# EAGLE design ep_project (EAGLE 9.6.2)
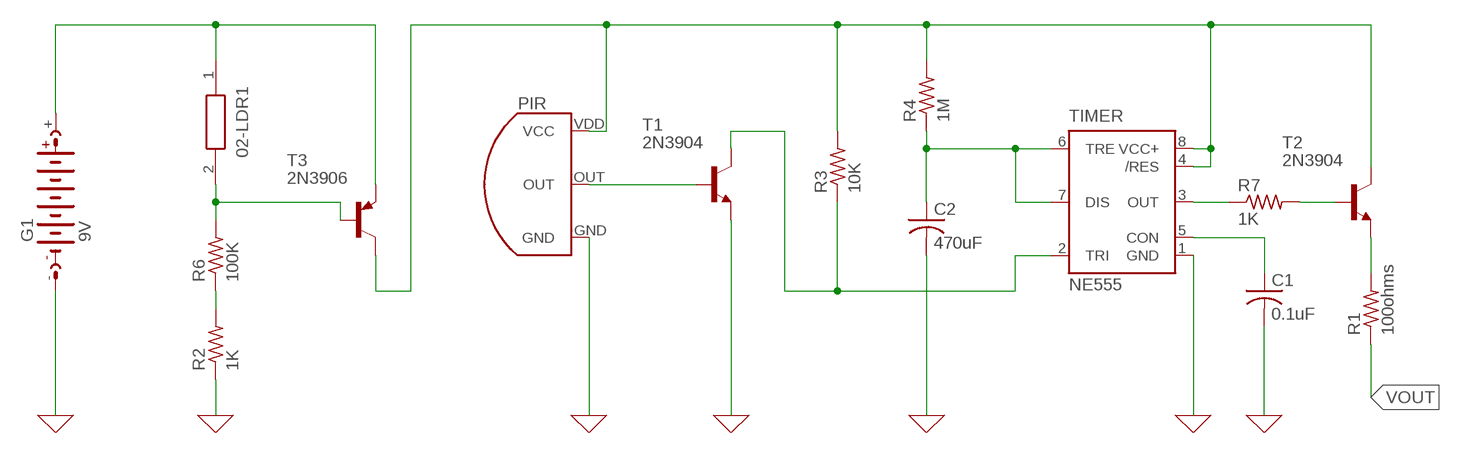
[diagram p0: schematic, sheet 1]

## Parts
C1  0.1uF  C-US025-024X044  [C025-024X044]
C2  470uF  C-US025-024X044  [C025-024X044]
G1  9V  AB9V  [AB9V]
PIR  EKMC4607112k  PIR_EKM4607112K  [TO-3]
R1  100ohms  R-US_M0805  [M0805]
R2  1K  R-US_M0805  [M0805]
R3  10K  R-US_M0805  [M0805]
R4  1M  R-US_M0805  [M0805]
R5  02-LDR1  [02LDR1]
R6  100K  R-US_M0805  [M0805]
R7  1K  R-US_M0805  [M0805]
T1  2N3904  [TO92]
T2  2N3904  [TO92]
T3  2N3906  [TO92]
TIMER  NE555  [DIL-08]

## Nets
0: C1.2 C2.2 G1.- PIR.GND R2.1 T1.3(E) TIMER.1(GND) ; supply symbol labelled GND
N$1: G1.+ R5.1 T3.3(E)
N$2: R5.2 R6.2 T3.2(B)
N$3: R2.2 R6.1
N$5: R3.1 T1.1(C) TIMER.2(TRI)
N$6: PIR.VDD(VCC) R3.2 R4.2 T2.1(C) T3.1(C) TIMER.4(/RES) TIMER.8(VCC+)
N$7: PIR.OUT T1.2(B)
N$8: C2.1 R4.1 TIMER.6(TRE) TIMER.7(DIS)
N$9: R1.2 T2.3(E)
N$11: R7.1 TIMER.3(OUT)
N$12: R7.2 T2.2(B)
N$13: C1.1 TIMER.5(CON)
VOUT: R1.1

## Library data of the parts
C1 = adafruit:C-US: CAPACITOR, American symbol; MF: KEMET; MPN: C0603C104M4RACTU.; OC_FARNELL: 1166968
C2 = adafruit:C-US: CAPACITOR, American symbol; MF: ILLINOIS CAPACITOR; MPN: 477CKE016M .; OC_FARNELL: 1203718
G1 = battery:AB9V: 9-V BATTERY CLIP; MF: KEYSTONE; MPN: 1294; OC_FARNELL: 1650674
PIR = Library:PIR_EKM: Panasonic EKMCX607112 PIR Sensor The low-power series of PIR sensors from Panasonic come in a 170 uA (4607) and 1 uA (1607) version.; MF: PANASONIC; MPN: EKMC1603111; OC_FARNELL: 2095731; PROD_ID: IC-15368
R1 = adafruit:R-US_: RESISTOR, American symbol; MF: MULTICOMP PRO; MPN: MCMF0W4FF1000A50; OC_FARNELL: 1652641
R2 R7 = adafruit:R-US_: RESISTOR, American symbol; MF: NEOHM - TE CONNECTIVITY; MPN: YR1B1K0CC; OC_FARNELL: 1083251
R3 = adafruit:R-US_: RESISTOR, American symbol; MF: NEOHM - TE CONNECTIVITY; MPN: YR1B10KCC; OC_FARNELL: 1083362
R4 = adafruit:R-US_: RESISTOR, American symbol; MF: VISHAY; MPN: MBB02070C1004FC100; OC_FARNELL: 2614373
R5 = 02-LDR1:02-LDR1: PHOTORESISTOR Source: Datasheet; DESCRIPTION: PHOTORESISTOR; HEIGHT: 2.4mm; MANUFACTURER_NAME: NTE; MANUFACTURER_PART_NUMBER: 02-LDR1; MF: EXCELITAS TECH; MPN: VT935G; OC_FARNELL: 1652638
R6 = adafruit:R-US_: RESISTOR, American symbol; MF: MULTICOMP PRO; MPN: MCMF0W2FF1003A10; OC_FARNELL: 1126841
T1 T2 = transistor:2N3904: NPN TRANSISTOR; MF: ONSEMI; MPN: 2N3904TFR.; OC_FARNELL: 1423151
T3 = transistor-pnp:2N3906: PNP Transistor; MF: MULTICOMP PRO; MPN: 2N3906; OC_FARNELL: 1574372
TIMER = st-microelectronics:NE555: General purpose bipolar Timer; MF: STMICROELECTRONICS; MPN: NE555N; OC_FARNELL: 1467742; OC_NEWARK: 89K1486

## Net classes
0 default: width 0.254 mm, drill 0.254 mm, clearance 0.254 mm

## Board
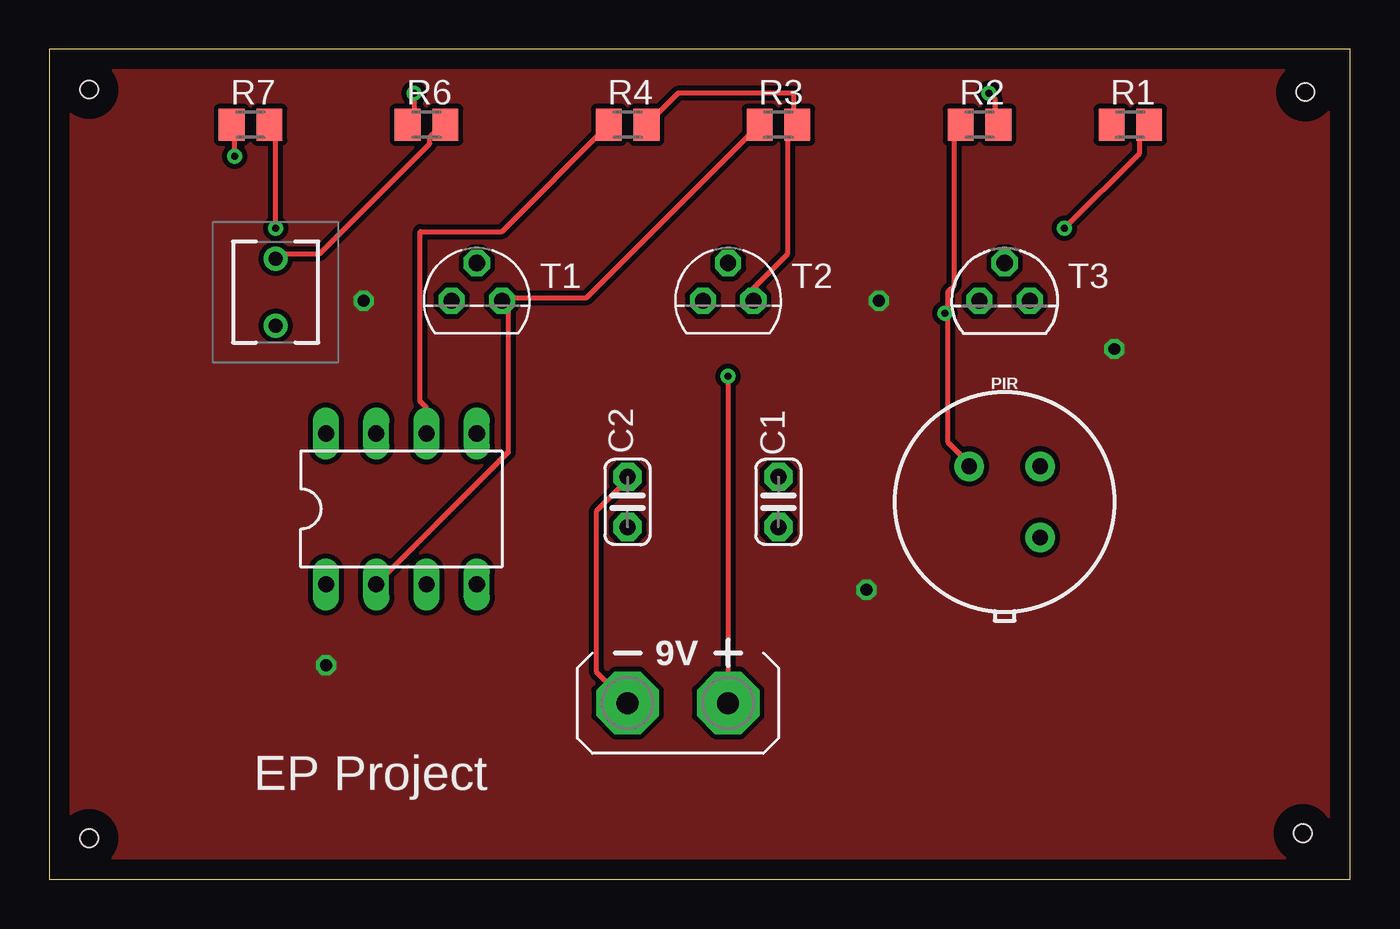
[diagram p1: board, top side]
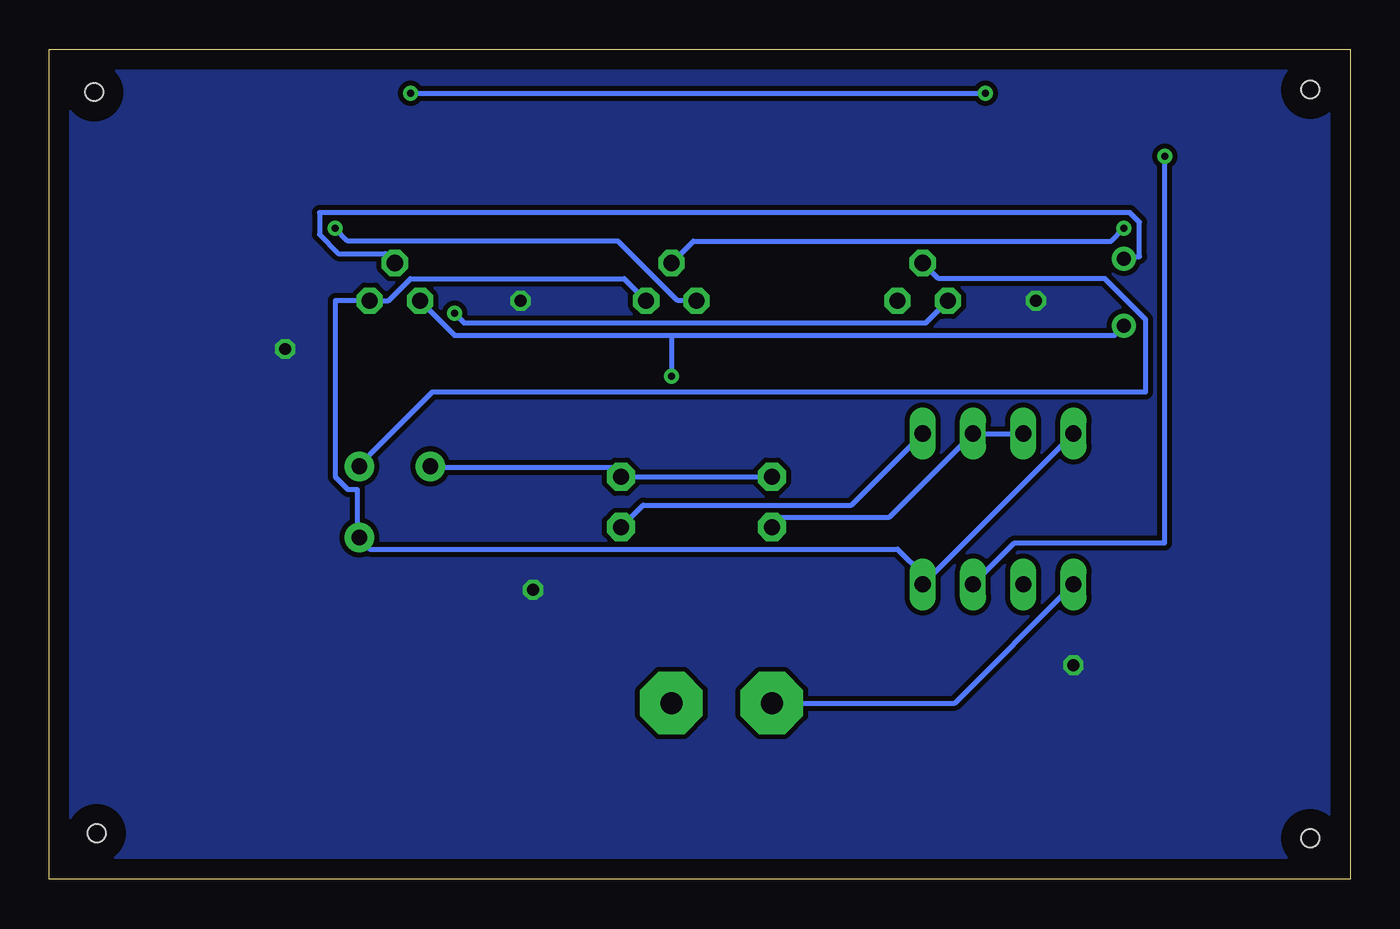
[diagram p2: board, bottom side, seen from below]

Size 65.71 x 41.9 mm. Coordinates in mm from the lower left corner, seen from the top.
Outline: 0,0 65.71,0 65.71,41.9 0,41.9 0,0
Copper layers (1*16): Top 0.035mm / dielectric 1.5mm / Bottom 0.035mm
Design rules "default": minimum track width 6mil, minimum drill 0.35mm, track to track 6mil, track to pad 6mil, pad to pad 6mil, via to via 6mil, smd to smd 6mil, copper to edge 40mil, drill to drill 6mil, minimum pad ring 10mil, minimum via ring 8mil, stop-mask expansion 4mil, vias tented up to drill 0mil, thermal gap 10mil
Holes 0.9 mm at 2.01,2.06 2.01,39.88 63.45,39.75 63.32,2.31

### Footprints (pad centres in the part's own frame; a part is rotated, then mirrored left to right if it is on the bottom)
C025-024X044 = drill 0.813 pad 1.422 octagon: 1 -1.27,0; 2 1.27,0
AB9V = drill 1.118 pad 3.15 octagon: + 0,2.54; - 0,-2.54
TO-3 = drill 0.8 pad 1.5: GND -1.796,1.796; OUT 1.796,1.796; VDD 1.796,-1.796
M0805 = smd 1.3 x 1.6: 1 -0.95,0; 2 0.95,0
02LDR1 = drill 0.7 pad 1.2: 1 0,0; 2 0,3.4
TO92 = drill 0.813 octagon: 1 1.27,0; 2 0,1.905; 3 -1.27,0
DIL-08 = drill 0.813 long: 1 -3.81,-3.81; 2 -1.27,-3.81; 3 1.27,-3.81; 4 3.81,-3.81; 5 3.81,3.81; 6 1.27,3.81; 7 -1.27,3.81; 8 -3.81,3.81

### Placement (x,y rotation side)
C1  36.83,19.05 90 top
C2  29.21,19.05 90 top
G1  31.75,8.89 270 top
PIR  48.26,19.05 0 top
R1  54.61,38.1 0 top
R2  46.99,38.1 0 top
R3  36.83,38.1 0 top
R4  29.21,38.1 0 top
R5  11.43,27.94 0 top
R6  19.05,38.1 0 top
R7  10.16,38.1 0 top
T1  21.59,29.21 0 top
T2  34.29,29.21 0 top
T3  48.26,29.21 0 top
TIMER  17.78,18.69 0 top

### Tracks (layer width: path | path; a pad name or v marks a point on that pad's centre or on a via)
0  (via drill 0.35)
  Top 0.254: 45.4,28.57 45.4,22.07 46.35,21.11 46.35,20.95 PIR.GND | 45.4,28.57 45.4,29.69 45.72,30 45.72,37.78 R2.1 | 45.4,28.57 v45.24,28.57 | G1.- 27.62,10.48 27.62,18.57 29.21,20.16 C2.2
  Bottom 0.254: TIMER.1 19.96,8.89 G1.- | C2.2 C1.2 37.31,20.8 46.35,20.8 PIR.GND | T1.3 21.43,28.1 44.77,28.1 v45.24,28.57
GND  (via drill 0.6)
  other vias: 15.88,29.21 41.91,29.21 41.27,14.61 13.97,10.79 53.8,26.77
  pour Top: -0.64,42.55 -0.64,-0.64 66.04,-0.64 66.04,42.55
  pour Bottom: -0.64,42.55 -0.64,-0.64 66.04,-0.64 66.04,42.55
N$1  (via drill 0.35)
  Top 0.254: v34.29,25.4 G1.+
  Bottom 0.254: R5.1 11.91,27.46 34.29,27.46 | 34.29,27.46 45.24,27.46 T3.3 | 34.29,27.46 v34.29,25.4
N$2
  Top 0.254: R5.2 11.43,31.59 13.65,31.59 19.21,37.15 19.21,37.47 19.84,38.1 R6.2
  Bottom 0.254: T3.2 48.74,31.59 51.12,31.59 52.07,32.54 52.07,33.66 11.11,33.66 10.64,33.18 10.64,31.43 11.43,31.43 R5.2
N$3  (via drill 0.35)
  Top 0.254: v18.41,39.69 18.41,38.26 18.26,38.1 R6.1 | v47.47,39.69 47.78,39.37 47.78,38.1 R2.2
  Bottom 0.254: v47.47,39.69 v18.41,39.69
N$5
  Top 0.254: 23.18,29.37 22.86,29.37 T1.1 23.18,29.37 | 23.18,29.37 27.15,29.37 R3.1 | TIMER.2 23.18,21.55 23.18,29.37
N$6
  Top 0.254: 37.62,38.1 37.62,39.69 31.75,39.69 R4.2 | 37.62,38.1 37.31,37.78 37.31,31.59 35.56,29.84 T2.1 | 37.62,38.1 R3.2
  Bottom 0.254: TIMER.8 TIMER.4 21.59,15.4 22.86,16.67 49.53,16.67 50.01,17.14 PIR.VDD 50.16,17.3 50.16,19.68 50.64,19.68 51.28,20.32 51.28,29.21 T3.1 48.58,29.21 47.47,30.32 36.67,30.32 T2.1
N$7
  Bottom 0.254: T1.2 20.8,30.32 12.38,30.32 10.32,28.26 10.32,24.61 46.35,24.61 50.01,20.95 PIR.OUT
N$8
  Top 0.254: TIMER.6 19.05,23.81 18.73,24.13 18.73,32.7 22.86,32.7 R4.1
  Bottom 0.254: TIMER.7 TIMER.6 23.3,18.26 28.73,18.26 C2.1
N$9  (via drill 0.35)
  Top 0.254: v51.28,32.86 55.09,36.67 55.09,37.78 55.4,38.1 R1.2
  Bottom 0.254: v51.28,32.86 50.64,32.23 36.99,32.23 33.97,29.21 T2.3
N$11  (via drill 0.35)
  Top 0.254: v9.37,36.51 9.37,38.1 R7.1
  Bottom 0.254: v9.37,36.51 9.37,16.99 16.95,16.99 TIMER.3
N$12  (via drill 0.35)
  Top 0.254: v11.43,32.86 11.43,37.78 R7.2
  Bottom 0.254: v11.43,32.86 12.06,32.23 33.18,32.23 T2.2
N$13
  Bottom 0.254: TIMER.5 25.2,18.89 35.72,18.89 C1.1

### Text on the board
tPlace: EP Project